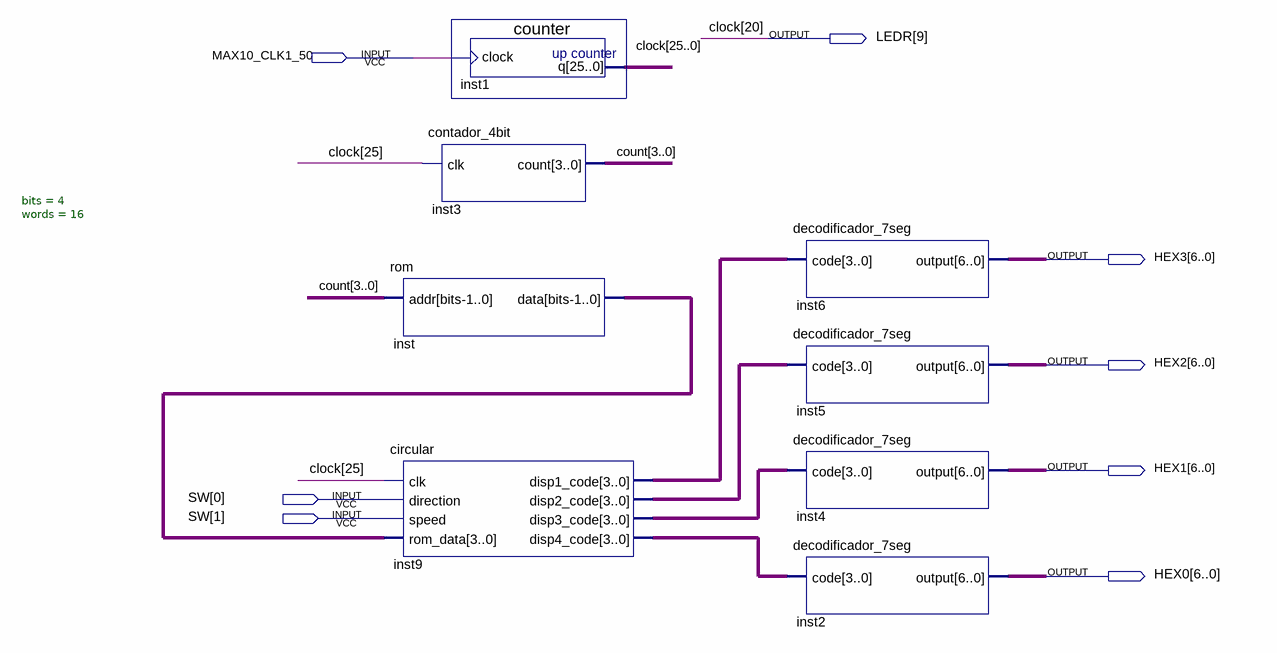
[diagram p0: schematic sheet]
// Quartus schematic Block1.bdf as structural Verilog: 8 symbols, 8 pins
module Block1 (
  input  MAX10_CLK1_50,
  input  [1:0] SW,
  output [9:9] LEDR,
  output [6:0] HEX3,
  output [6:0] HEX2,
  output [6:0] HEX1,
  output [6:0] HEX0
);

  wire [3:0] count, inst9_disp1_code, inst9_disp2_code, inst9_disp3_code, inst9_disp4_code, inst_data;
  wire [25:0] clock;

  contador_4bit inst3 (.clk(clock[25]), .count(count));
  rom #(.bits(4), .words(16)) inst (.addr(count), .data(inst_data));
  circular inst9 (
    .clk(clock[25]), .direction(SW[0]), .speed(SW[1]), .rom_data(inst_data), .disp1_code(inst9_disp1_code),
    .disp2_code(inst9_disp2_code), .disp3_code(inst9_disp3_code), .disp4_code(inst9_disp4_code));
  counter inst1 (.clock(MAX10_CLK1_50), .q({clock[25:21], LEDR[9], clock[19:0]}));
  decodificador_7seg inst6 (.code(inst9_disp1_code), .\output (HEX3));
  decodificador_7seg inst5 (.code(inst9_disp2_code), .\output (HEX2));
  decodificador_7seg inst4 (.code(inst9_disp3_code), .\output (HEX1));
  decodificador_7seg inst2 (.code(inst9_disp4_code), .\output (HEX0));

  // Other names for the same wires on the sheet: clock[20] = LEDR[9]
endmodule
